# Altium schematic sheet CAN_ESP_control.SchDoc
size A4; SheetNumber: 3; SheetTotal: 5
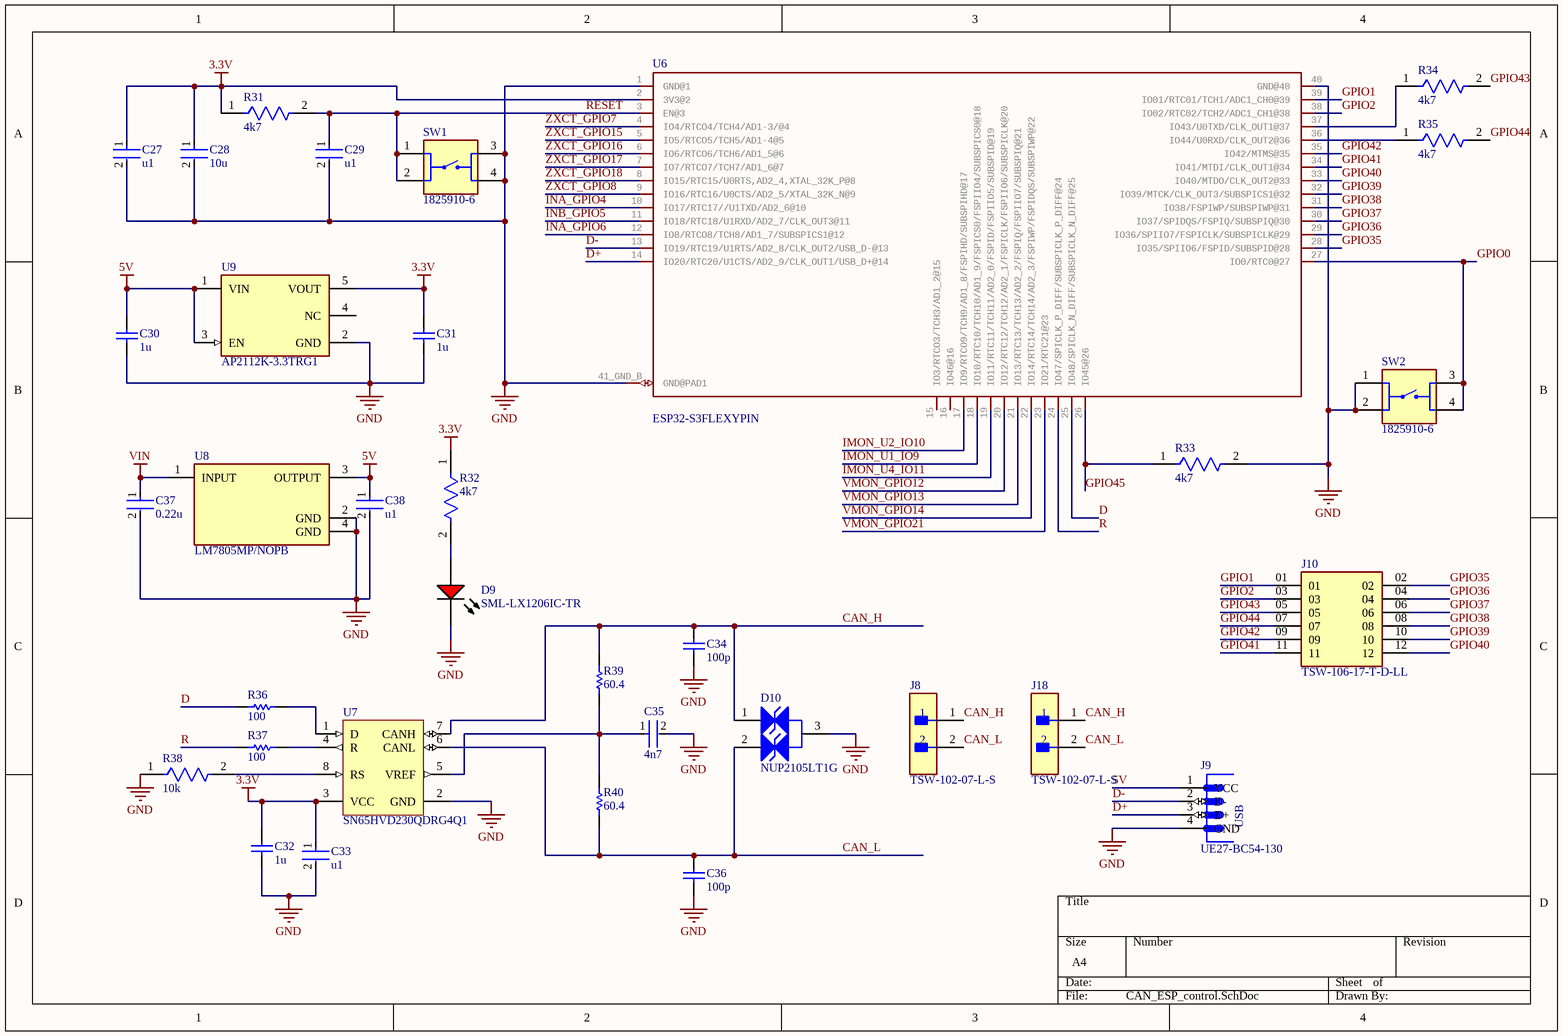
[diagram p0: CAN_ESP_control.SchDoc]

## Parts
C27  u1  [FP-CC0805-0_85-MFG]
C28  10u  [FP-C0805C-DG-MFG]
C29  u1  [FP-CC0805-0_85-MFG]
C30  1u  [CAPC2013X140X50ML20T25]
C31  1u  [CAPC2013X140X50ML20T25]
C32  1u  [CAPC2013X140X50ML20T25]
C33  u1  [FP-CC0805-0_85-MFG]
C34  100p  [CAPC2013X88X50ML20T25]
C35  4n7  [FP-0805-L_2_01_0_2-W_1_25-IPC_B]
C36  100p  [CAPC2013X88X50ML20T25]
C37  0.22u  [FP-C0805C-DN-MFG]
C38  u1  [FP-CC0805-0_85-MFG]
D9  SML-LX1206IC-TR  [LUMX-SML-LX1206IC_V]
D10  NUP2105LT1G  [ONSC-SOT-23-3-318-08_V]
J8  TSW-102-07-L-S  [FP-TSW-102-07-L-S-MFG]
J9  UE27-BC54-130  [AMPHENOL_UE27-BC54-130]
J10  TSW-106-17-T-D-LL  [SAMTEC_TSW-106-17-T-D-LL]
J18  TSW-102-07-L-S  [FP-TSW-102-07-L-S-MFG]
R31  4k7  [FP-CRCW0805-e3-IPC_B]
R32  4k7  [FP-CRCW0805-e3-IPC_B]
R33  4k7  [FP-CRCW0805-e3-IPC_B]
R34  4k7  [FP-CRCW0805-e3-IPC_B]
R35  4k7  [FP-CRCW0805-e3-IPC_B]
R36  100  [RESC2013X60X35ML10T20]
R37  100  [RESC2013X60X35ML10T20]
R38  10k  [FP-ERA3A-IPC_C]
R39  60.4  [RESC2013X60X35LL10T20]
R40  60.4  [RESC2013X60X35LL10T20]
SW1  1825910-6  [SW_1825910-6-4]
SW2  1825910-6  [SW_1825910-6-4]
U6  ESP32-S3FLEXYPIN  [ESP32-S3-FLEXYPIN]
U7  SN65HVD230QDRG4Q1  [D0008A_M]
U8  LM7805MP/NOPB  [FP-DCY0004A-MFG]
U9  AP2112K-3.3TRG1  [FP-SOT25-IPC_A]

## Nets
3.3V: C27.1 C28.1 C31.2 C32.2 C33.1 R31.1 R32.1 U6.2(3V3@2) U7.3(VCC) U9.5(VOUT)
5V: C30.2 C38.1 J9.1(VCC) U8.3(OUTPUT) U9.1(VIN) U9.3(EN)
GND: C27.2 C28.2 C29.2 C30.1 C31.1 C32.1 C33.2 C34.1 C35.2 C36.1 C37.2 C38.2 D9.2(K) D10.3(K) J9.4(GND) R33.2 R38.1 SW1.3 SW1.4 SW2.1 SW2.2 U6.1(GND@1) U6.40(GND@40) U6.41_GND(GND-PAD1) U7.2(GND) U8.2(GND) U8.4(GND) U9.2(GND)
VIN: C37.1 U8.1(INPUT)
CAN_H: C34.2 D10.1(K) J8.1 J18.1 R39.2 U7.7(CANH)
CAN_L: C36.2 D10.2(K) J8.2 J18.2 R40.1 U7.6(CANL)
D: R36.1 U6.25(IO48/SPICLK_N_DIFF/SUBSPICLK_N_DIFF@25)
D+: J9.3(D+) U6.14(IO20/RTC20/U1CTS/AD2_9/CLK_OUT1/USB_D+@14)
D-: J9.2(D-) U6.13(IO19/RTC19/U1RTS/AD2_8/CLK_OUT2/USB_D-@13)
GPIO0: SW2.3 SW2.4 U6.27(IO0/RTC0@27)
GPIO1: J10.01 U6.39(IO01/RTC01/TCH1/ADC1_CH0@39)
GPIO2: J10.03 U6.38(IO02/RTC02/TCH2/ADC1_CH1@38)
GPIO35: J10.02 U6.28(IO35/SPIIO6/FSPID/SUBSPID@28)
GPIO36: J10.04 U6.29(IO36/SPIIO7/FSPICLK/SUBSPICLK@29)
GPIO37: J10.06 U6.30(IO37/SPIDQS/FSPIQ/SUBSPIQ@30)
GPIO38: J10.08 U6.31(IO38/FSPIWP/SUBSPIWP@31)
GPIO39: J10.10 U6.32(IO39/MTCK/CLK_OUT3/SUBSPICS1@32)
GPIO40: J10.12 U6.33(IO40/MTDO/CLK_OUT2@33)
GPIO41: J10.11 U6.34(IO41/MTDI/CLK_OUT1@34)
GPIO42: J10.09 U6.35(IO42/MTMS@35)
GPIO43: J10.05 R34.2
GPIO44: J10.07 R35.2
GPIO45: R33.1 U6.26(IO45@26)
IMON_U1_IO9: U6.18(IO10/RTC10/TCH10/AD1_9/FSPICS0/FSPIIO4/SUBSPICS0@18)
IMON_U2_IO10: U6.17(IO9/RTCO9/TCH9/AD1_8/FSPIHD/SUBSPIHD@17)
IMON_U4_IO11: U6.19(IO11/RTC11/TCH11/AD2_0/FSPID/FSPIIO5/SUBSPID@19)
INA_GPIO4: U6.10(IO17/RTC17//U1TXD/AD2_6@10)
INA_GPIO6: U6.12(IO8/RTCO8/TCH8/AD1_7/SUBSPICS1@12)
INB_GPIO5: U6.11(IO18/RTC18/U1RXD/AD2_7/CLK_OUT3@11)
R: R37.1 U6.24(IO47/SPICLK_P_DIFF/SUBSPICLK_P_DIFF@24)
RESET: C29.1 R31.2 SW1.1 SW1.2 U6.3(EN@3)
VMON_GPIO12: U6.20(IO12/RTC12/TCH12/AD2_1/FSPICLK/FSPIIO6/SUBSPICLK@20)
VMON_GPIO13: U6.21(IO13/RTC13/TCH13/AD2_2/FSPIQ/FSPIIO7/SUBSPIQ@21)
VMON_GPIO14: U6.22(IO14/RTC14/TCH14/AD2_3/FSPIWP/FSPIDQS/SUBSPIWP@22)
VMON_GPIO21: U6.23(IO21/RTC21@23)
ZXCT_GPIO7: U6.4(IO4/RTCO4/TCH4/AD1-3/@4)
ZXCT_GPIO8: U6.9(IO16/RTC16/U0CTS/AD2_5/XTAL_32K_N@9)
ZXCT_GPIO15: U6.5(IO5/RTCO5/TCH5/AD1-4@5)
ZXCT_GPIO16: U6.6(IO6/RTCO6/TCH6/AD1_5@6)
ZXCT_GPIO17: U6.7(IO7/RTCO7/TCH7/AD1_6@7)
ZXCT_GPIO18: U6.8(IO15/RTC15/U0RTS,AD2_4,XTAL_32K_P@8)
NetC35_1: C35.1 R39.1 R40.2 U7.5(VREF)
NetD9_1: D9.1(A) R32.2
NetR34_1: R34.1 U6.37(IO43/U0TXD/CLK_OUT1@37)
NetR35_1: R35.1 U6.36(IO44/U0RXD/CLK_OUT2@36)
NetR36_2: R36.2 U7.1(D)
NetR37_2: R37.2 U7.4(R)
NetR38_2: R38.2 U7.8(RS)

Not connected (* = marked no-connect by the designer): U6 15(IO3/RTCO3/TCH3/AD1_2@15) 16(IO46@16) 41_GND_B(GND@PAD1); U9 4(NC)

## Notes on the sheet
- (in symbol UE27-BC54-130) USB

## Library data of the parts
C27 C29 C33 C38 = CMP-2100-03606-3: CC0805KRX7R9BB104 CAP CER 0.1UF 50V X7R 0805; Manufacturer: Yageo; Tolerance: 0.1; Capacitance: 100 nF; Value: 100 nF; Material: Ceramic; Device Class L1: Passive Components; ComponentLink2Description: Datasheet; Package: CC0805-0.85; Manufacturer Part Number: CC0805KRX7R9BB104; Digikey Description: CAP CER 0.1UF 50V X7R 0805; Device Class L3: Ceramic Capacitors; Temperature: -30°C to +85°C; Temperature Characteristic: X7R; Voltage Rating: 50 V; Height: 0.95mm; RoHS: TRUE; Ipc Land Pattern Name: CAPC200125X85; Device Class L2: Capacitors; Category: Cap; Temperature Range Low: -30°C; Temperature Range High: +85°C; Mouser Description: Multilayer Ceramic Capacitors MLCC - SMD/SMT 100nF 50V X7R 10%; Footprint Url: http://www.yageo.com/exep/pages/download/literatures/UPY-C_GEN_24.pdf; Automotive: No; Octopart: https://octopart.com/cc0805krx7r9bb104-yageo-192993; Lead Free: Yes; ComponentLink2URL: http://www.yageo.com/documents/recent/UPY-GPHC_Y5V_6.3V-to-50V_8.pdf
C28 = CMP-2007-03243-2: CAP CER 10UF 10V X5R 0805; Manufacturer Part Number: C0805C106K8PACTU; Manufacturer: Kemet; 3DS Part Number: 220-00001; Tolerance: 10%; Temperature Coefficient: 15%; Material: Ceramic; Device Class L2: Capacitors; Device Class L1: Passive Components; ComponentLink2URL: https://content.kemet.com/datasheets/KEM_C1006_X5R_SMD.pdf; Height: 1.4mm; Lead Free: Yes; Digikey Description: CAP CER 10UF 10V X5R 0805; Octopart: https://octopart.com/c0805c106k8pactu-kemet-98697; Capacitance: 10uF; Value: 10uF; Temperature Range Low: -55°C; Temperature: -55°C to +85°C; Automotive: No; Mouser Description: CAP CER 10UF 10V X5R 0805; Ipc Land Pattern Name: CAPC200125X125; Temperature Range High: +85°C; Voltage: 10V; RoHS: TRUE; Device Class L3: Ceramic Capacitors; ComponentLink2Description: Datasheet; Voltage Rating: 10V; Package: C0805C-DG; Temperature Characteristic: X5R; Category: Cap
C30-C32 = CMP-2007-03236-1: Manufacturer: Kemet; Part Number: C0805C105K5RACTU
C34 C36 = CMP-2007-00459-1: C0805C101JCGACTU; Manufacturer: Kemet; Part Number: C0805C101JCGACTU
C35 = CMP-1036-03594-3: 08055C472KAT2A General Purpose Ceramic Capacitor, 0805, 4.7nF, 10%, X7R, 0.15, 50V; Dissipation Factor: 2.5%; Insulation Resistance: 100GR; Depth: 1.25mm; Width: 1.25mm; Construction: Flat; Series: -; Termination: SMD/SMT; Case Code (Imperial): 0805; Voltage Rating: 50V; Number of Pins: 2; Voltage Rating (DC): 50V; Dielectric Material: Ceramic; Capacitance: 4.7nF; Thickness: 0.037inch; Package Quantity: 1; Mount: Surface Mount; Voltage: 50V; Min Operating Temperature: -55°C; Size: 0.94mm; Packaging: Tape and Reel; Dielectric: X7R; RoHS Compliant: Yes; REACH SVHC: No SVHC; Tolerance: 10%; Length: 2.01mm; Lead Free: Lead Free; Radiation Hardening: No; Case/Package: 0805; Case Code (Metric): 2012; Max Operating Temperature: 125°C; Height: 0.94mm; Contact Plating: Tin
C37 = CMP-1036-04552-2: CAP CER 0.22UF 50V X7R 0805; Manufacturer: KEMET; Manufacturer Part Number: C0805C224K5RACTU; Value: 0.22 μF; Temperature Coefficient: 30ppm/°C; Material: Ceramic; Tolerance: 0.1; ComponentLink2URL: https://content.kemet.com/datasheets/KEM_C1003_C0G_SMD.pdf; Temperature Characteristic: X7R; Device Class L3: Ceramic Capacitors; Lead Free: Yes; Temperature: -55°C to +125°C; RoHS: TRUE; Capacitance: 0.22 μF; Automotive: No; Octopart: https://octopart.com/c0805c224k5ractu-kemet-144670; Temperature Range Low: -55°C; Height: 0.88mm; Device Class L1: Passive Components; Digikey Description: CAP CER 0.22UF 50V X7R 0805; ComponentLink2Description: Datasheet; Mouser Description: CAP CER 0.22UF 50V X7R 0805; Category: Cap; Ipc Land Pattern Name: CAPC200125X78; Temperature Range High: +125°C; Package: C0805C-DN; Device Class L2: Capacitors; Voltage Rating: 50 V
D9 = CMP-2000-07123-1: LED Red, 65 mW, -40 to 85 degC, 2-Pin SMD, RoHS, Tape and Reel; Manufacturer: Lumex; LED Material: GaAsP; Peak Wavelength: 635nm; Number of LEDs: 1; Viewing Angle: 160; Reverse Voltage: 5(Min)V; Lens Appearance: ColorlessNonDiffused; Intensity: 6mcd; Type: Uni-Color; Pin_Count: 2; Lens Dimensions: 2x1.6x0.5mm; Mounting: SurfaceMount; ECCN: EAR99; RoHS: Unknown; Package Description: 2-Pin Surface Mount Device, Body 3.2 x 1.5 mm; Mounting Technology: SurfaceMount; Dominant Wavelength: N/A; Supplier_Package: SMD; Supplier Standard Pack: 3,000; Color: Red; Dimension: 3.2x1.6x1.1mm; HTS: 8541402000; Part No: SML-LX1206IC-TR; Family: SML-LX1206IC; Supplier: Lumex; Datasheet URL: http://www.lumex.com/content/files/ProductAttachment/SML-LX1206IC-TR.pdf; Package Reference: SML-LX1206IC; Manufacturer URL: http://www.lumexinstruments.com/; Operating Temperature: -25to85C; Packaging: TapeandReel; Datasheet Version: Rev. J, 08/2012
D10 = CMP-1063-00164-1: Dual Line CAN Bus Protector, 3-Pin SOT-23, Pb-Free, Tape and Reel; Manufacturer: On Semiconductor; IR Max (uA): 0.1; Number of Lines: 2; Direction: Bidirectional; C Max (pF): 30; PPK Max (W): 350; V(BR) Min (V): 26.2; ComponentLink3URL: http://www.onsemi.cn/pub_link/Collateral/318-08.PDF; Mounting Technology: Surface Mount; ComponentLink2Description: Datasheet; PartNumber: NUP2105LT1G; ComponentLink1URL: http://www.onsemi.com/; PackageVersion: Rev. AP, 11/2009; DatasheetVersion: Rev. 5; RoHS: Pb-Free; PackageReference: SOT-23-3-318-08; ComponentLink2URL: http://www.onsemi.cn/pub_link/Collateral/NUP2105L-D.PDF; ComponentLink1Description: Manufacturer URL; PackageDescription: 3-Pin Small Outline Transistor, Body 2.92 x 1.3 mm, Pitch 0.95 mm; Packing: Tape and Reel; ComponentLink3Description: Package Specification
J8 J18 = CMP-02766-001428-1: CONN HEADER VERT 2POS 2.54MM; Voltage Rating: 550V; Current Rating: 7.6A; Gender: Male; Number of Contacts: 2; Connector Type: Male Pin; Radiation Hardening: No; Orientation: Straight; Contact Plating: Gold; Max Operating Temperature: 125°C; Mount: Through Hole; Package Quantity: 1; Number of Rows: 1; Housing Material: Polyester; RoHS Compliant: Yes; Length: 5.08mm; Max Voltage Rating (AC): 550V; Pitch: 2.54mm; Packaging: Bulk; Depth: 2.54mm; Termination: Solder; Min Operating Temperature: -55°C; Housing Color: Black; Lead Free: Lead Free; Color: Black; Number of Positions: 2; Width: 2.54mm; Max Current Rating: 7.6A; REACH SVHC: No SVHC; Contact Material: Bronze; Contact Mating Length: 0.23inch; Series: TSW; Contact Type: Male Pin
J9 = UE27-BC54-130: connector, universal serial bus, type b, rt angle receptacle, black, 4 contact; Package: None; Price: None; Value: *; MP: UE27-BC54-130; Availability: Unavailable
R31-R35 = CMP-2100-03615-2: CRCW08054K70FKEARES Thick Film, 4.7kΩ, 1%, 0.125W, 100ppm/°C, 0805; Max Power Dissipation: 125mW; Resistance: 4.7kR; Voltage Rating: 150V; Termination: SMD/SMT; Weight: 0.000194oz; Case/Package: 0805; Number of Terminations: 2; Min Operating Temperature: -55°C; Case Code (Metric): 2012; Package Quantity: 10; Depth: 1.25mm; Military Standard: Not; Composition: Thick Film; Radiation Hardening: No; Contact Plating: Tin; Height: 0.45mm; Power Rating: 125mW; Features: Automotive AEC-Q200; Tolerance: 1%; Packaging: Tape and Reel; Max Operating Temperature: 155°C; Length: 2mm; Case Code (Imperial): 0805; Voltage Rating (DC): 150V; Width: 1.25mm; Temperature Coefficient: 100ppm/°C; Lead Free: Lead Free
R36 R37 = CMP-2100-03669-1: RC0805FR-07100RL Chip Resistor, 100 Ohm, +/-1%, 0.125 W, -55 to 155 degC, 0805 (2012 Metric), RoHS, Tape and Reel; Manufacturer: Yageo; Power Rating: 125mW; Resistance: 100Ohm; Voltage Rating: 150V; Tolerance: 1%; Temperature Coefficient: 100ppm/degreesC; Length: 2mm; Package Description: 2-Pin Surface Mounted Device, Body 2 x 1.25 mm; Case Code (Imperial): 0805; Number of Pins: 2; Termination: SMD/SMT; Lead Pitch: 0.4mm; Package Quantity: 1; Height: 0.024inch; Case Code (Metric): 2012; Number of Terminations: 2; Datasheet Version: Rev. 5, 10/2016; Lead Free: LeadFree; Package Reference: 0805; Composition: ThickFilm; REACH SVHC: Unknown; Voltage Rating (DC): 150V; Min Operating Temperature: -55degC; Packaging: TapeandReel; Military Standard: Not; Case/Package: 0805; Datasheet URL: http://www.yageo.com/NewPortal/yageodocoutput?fileName=/pdf/R-Chip/PYu-RC_Group_51_RoHS_L_5.pdf; Max Operating Temperature: 155degC; Manufacturer URL: http://www.yageo.com/; Max Power Dissipation: 125mW; Width: 0.049inch; Depth: 1.25mm; RoHSCompliant: true
R38 = CMP-2000-00874-2: RES SMD 10K OHM 0.1% 1/10W 0603; Voltage Rating (DC): 75V; Power Rating: 100mW; Resistance: 10kR; Temperature Coefficient: 25ppm/°C; Radiation Hardening: No; Width: 0.8mm; Depth: 0.8mm; Construction: Rectangular; Case Code (Metric): 1608; Package Quantity: 5000; Length: 1.6mm; Size Code: 0603; Case Code (Imperial): 0603; Termination: SMD/SMT; Contact Plating: Tin; Resistance Tolerance: 0.1%; Military Standard: Not; Packaging: Tape and Reel; Max Power Dissipation: 100mW; REACH SVHC: No SVHC; Series: ERA-3A; Voltage Rating: 75V; Lead Free: Lead Free; Technology: METAL FILM; RoHS Compliant: Yes; Max Operating Temperature: 155°C; Resistor Type: Thin Film; Min Operating Temperature: -55°C; Number of Pins: 2; Case/Package: 0603; Tolerance: 0.1%; Height: 0.45mm; Mount: Surface Mount; Number of Terminations: 2
R39 R40 = CMP-2001-01223-1: RC0805FR-0760R4L; Manufacturer: Yageo; Part Number: RC0805FR-0760R4L
SW1 SW2 = 1825910-6: Switch Push Button OFF (ON) SPST Round Button 0.05A 24VDC Momentary Contact PC Pins Thru-Hole; MF: TE Connectivity; Value: *; MP: 1825910-6; Package: None; Check_prices: https://www.snapeda.com/parts/1825910-6/TE+Connectivity+ALCOSWITCH+Switches/view-part/?ref=eda; SnapEDA_Link: https://www.snapeda.com/parts/1825910-6/TE+Connectivity+ALCOSWITCH+Switches/view-part/?ref=snap; Digi-Key_Part_Number: 450-1650-ND; Purchase-URL: https://pricing.snapeda.com/search/part/1825910-6/?ref=eda
U7 = CMP-0315-00041-2: Automotive Catalog 3.3 V CAN Transceiver, 17 mA, -40 to 125 degC, 8-pin SOIC (D), Green (RoHS & no Sb/Br); Manufacturer: Texas Instruments; ICC(Max)(mA): 17; Drivers Per Package: 1; Supply Voltage(s)(V): 3.3; Transient Pulse Protection(V): -25 to 25; PackageDescription: 8-Pin Plastic Small Outline Integrated Circuit, 4.9 x 3.9 mm, Pitch 1.27 mm Pitch; SubFamily: CAN; Rating: Automotive; ComponentLink1Description: Datasheet; Receivers Per Package: 1; Isolated: No; DatasheetVersion: SGLS398A; PackageReference: D0008A; PartNumber: SN65HVD230QDRG4Q1; Code_JEDEC: MS-012AA; Footprint: PCA82C250; Eco-Plan: Green (RoHS & no Sb/Br); PackageVersion: revM, Jun-2011; ComponentLink1URL: http://www.ti.com/general/docs/lit/getliterature.tsp?genericPartNumber=SN65HVD230Q-Q1&fileType=pdf; Mounting Technology: Surface Mount
U8 = CMP-04917-000007-1: IC REG LINEAR 5V 1.5A SOT223-4; Manufacturer: Texas Instruments; Max Supply Voltage: 30V; Description: Linear Voltage Regulator IC 1 Output 1.5A SOT-223-4; Max Junction Temp: +150°C; Number Of Outputs: 1; Standoff Height: 0.02mm; Dropout Voltage: 2V; Accuracy Percentage: 3%; Nominal Supply Current: 8mA; Output Type: Fixed; Min Supply Voltage: 7.5V; Lead Free: Yes; Device Class L1: Integrated Circuits (ICs); Manufacturer Part Number: LM7805MP/NOPB; Package: DCY0004A; ComponentLink2Description: Datasheet; Temperature Range Low: 0°C; ComponentLink2URL: http://www.ti.com/lit/ds/symlink/lm7800.pdf; Height: 1.8mm; Temperature: 0°C to +125°C; Category: IC; Device Class L3: Voltage Regulators - Linear; Octopart: https://octopart.com/lm7805mp%2Fnopb-texas+instruments-74629991; Device Class L2: Power Management ICs; Output Voltage: 5V; RoHS: TRUE; Temperature Range High: +125°C; Automotive: No; Digikey Description: IC REG LINEAR 5V 1.5A SOT223-4; Output Current: 1.5A
U9 = CMP-12756-000035-1: IC REG LINEAR 3.3V 600MA SOT25; Number of Regulators: 1; Output Type: Fixed; Polarity: Positive; Min Input Voltage: 2.5V; Max Input Voltage: 6V; Accuracy: 1.5%; Quiescent Current: 55uA; Dropout Voltage: 250mV; Min Operating Temperature: -40°C; Length: 3.1mm; Output Current: 600mA; Max Operating Temperature: 85°C; Package Quantity: 1; Output Voltage: 3.3V; Width: 1.7mm; Number of Outputs: 1; Packaging: Tape and Reel; Height: 1.3mm; Lead Free: Lead Free; Max Output Current: 600mA; Case/Package: SOT-23-5; Mount: Surface Mount; Number of Pins: 5
J10 = TSW-106-17-T-D-LL: Package: None; Price: None; Value: *; MP: TSW-106-17-T-D-LL; Availability: Unavailable